# EasyEDA schematic SCH_GroeiAcademie-Arduino_Uno_R3-R4_Shield-v0.10.0_2026-07-25.json
TITLE: Stimulus: Arduino UNO R3/R4 + ADS1115; REV: 0.10.0; Date: 2026-07-25; Sheet: 1/1; Drawn By: Alex Peeters; Company: GROEI ACADEMIE
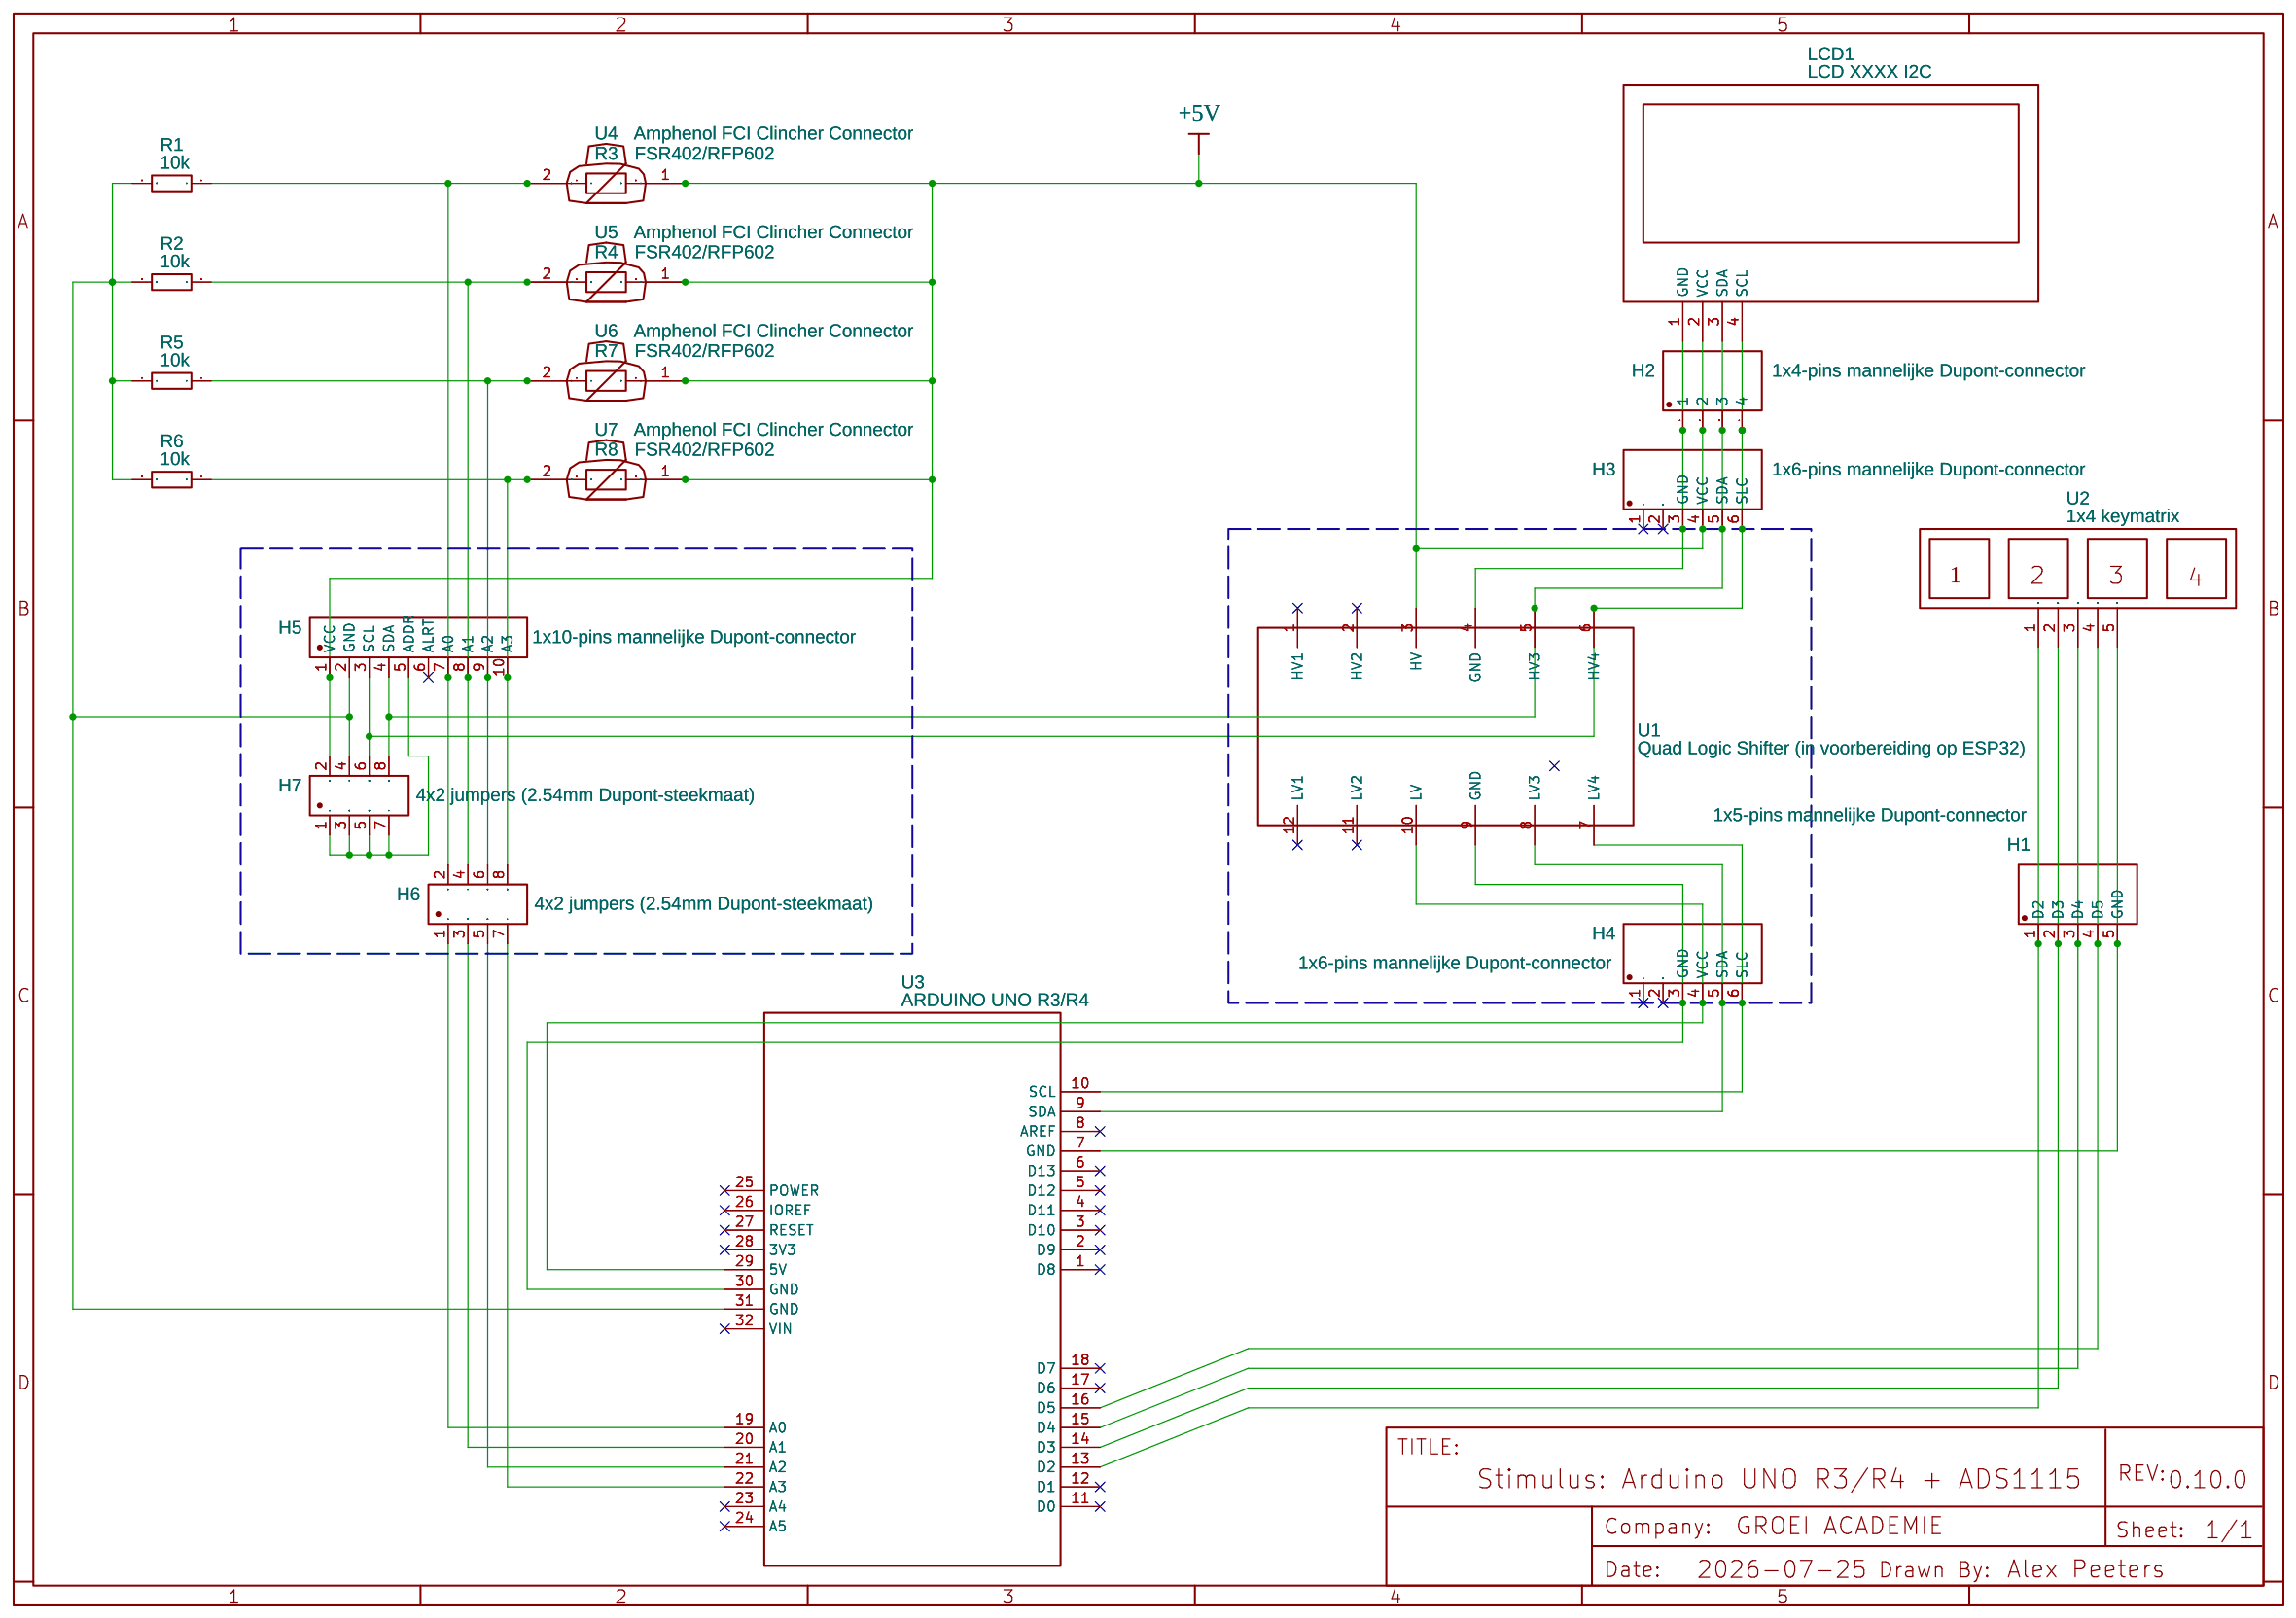
[diagram p0: schematic sheet]

## Parts
H1  1x5-pins mannelijke Dupont-connector  [HDR-TH_5P-P2.54-V-M]
H2  1x4-pins mannelijke Dupont-connector  [HDR-TH_4P-P2.54-V-M]
H3  1x6-pins mannelijke Dupont-connector  [HDR-TH_6P-P2.54-V_Z-211-0611-0021-001]
H4  1x6-pins mannelijke Dupont-connector  [HDR-TH_6P-P2.54-V_Z-211-0611-0021-001]
H5  1x10-pins mannelijke Dupont-connector  [HDR-TH_10P-P2.54-V-M]
H6  4x2 jumpers (2.54mm Dupont-steekmaat)  [HDR-SMD_8P-P2.54-V-M-R2-C4-LS7.4]
H7  4x2 jumpers (2.54mm Dupont-steekmaat)  [HDR-SMD_8P-P2.54-V-M-R2-C4-LS7.4]
LCD1  LCD XXXX I2C  [HDR-M-2.54_1X4]
R1  10k  [WEERSTAND _P 10MM]
R2  10k  [WEERSTAND _P 10MM]
R3  FSR402/RFP602  [FSR400]
R4  FSR402/RFP602  [FSR400]
R5  10k  [WEERSTAND _P 10MM]
R6  10k  [WEERSTAND _P 10MM]
R7  FSR402/RFP602  [FSR400]
R8  FSR402/RFP602  [FSR400]
U1  Quad Logic Shifter (in voorbereiding op ESP32)  [LOGIC SHIFTER 4 CH]
U2  1x4 keymatrix  [KEYPAD1X4]
U3  ARDUINO UNO R3/R4  [UNO_R3]
U4  Amphenol FCI Clincher Connector  [AT04-2P]
U5  Amphenol FCI Clincher Connector  [AT04-2P]
U6  Amphenol FCI Clincher Connector  [AT04-2P]
U7  Amphenol FCI Clincher Connector  [AT04-2P]

## Library data of the parts
H1 = 210S-1*5P L=11.6MMGold-plated black: Contributor: LCSC; Supplier: LCSC; Manufacturer: Ckmtw(灿科盟); Manufacturer Part: B-2100S05P-A110; Supplier Part: C124379; JLCPCB Part Class: Extended Part
H2 = Header-Male-2.54_1x4: Contributor: LCSC; Supplier: LCSC; Manufacturer: Ckmtw(灿科盟); Manufacturer Part: B-2100S04P-A110; Supplier Part: C124378; JLCPCB Part Class: Extended Part
H3 H4 = 210S-1*6P L=11.6MMGold-plated black: Contributor: LCSC; Supplier: LCSC; Manufacturer: Ckmtw(灿科盟); Manufacturer Part: B-2100S06P-A110; Supplier Part: C124380; JLCPCB Part Class: Extended Part
H5 = 2.54-1*10: Contributor: lcsc; Supplier: LCSC; Supplier Part: C5156617; Manufacturer: ZHOURI(洲日); JLCPCB Part Class: Extended Part
H6 H7 = 2.54-2*4P立贴针: Contributor: LCSC; Supplier: LCSC; Supplier Part: C192300; Manufacturer: BOOMELE(博穆精密); JLCPCB Part Class: Extended Part
LCD1 = I2CLCD16X2_N: Contributor: abdenoura70
R1 R2 R5 R6 = 330Ω (331) ±5%: Supplier: LCSC; Supplier Part: C10322; Manufacturer: Made in China; Contributor: Oldman2019; JLCPCB Part Class: Extended Part
R3 R4 R7 R8 = FSR402-OPCION1: Contributor: N.Morisaki
U1 = Quad Logic Shifter: Contributor: wsarchibald1
U2 = Клавиатура 4*4: Contributor: oleg12062005; sourceId: AztLFXf9r
U3 = UNO_R3: sourceId: 1T5FDZYC8
U4-U7 = AT04-2P: Manufacturer: Amphenol; Manufacturer Part: AT04-2P-BM02; Supplier: Mouser; Supplier Part: 654-AT04-2P-BM02; link: https://www.amphenol-sine.com/AT04-2P-BM02-2-Position-PCB-Flange-Mount-Receptacle-Pin-Gold-Plated-Contacts-Included-Potting-Black_p_9831.html; Contributor: aryde

## Nets
+5V: H2.2 H3.4(VCC) H5.1(VCC) H7.2 LCD1.2(VCC) R3.2 R4.2 R7.2 R8.2 U1.3(HV) U4.1 U5.1 U6.1 U7.1
Net-(H1-1): H1.1(D2) U2.1(C1) U3.13(D2)
Net-(H1-2): H1.2(D3) U2.2(C2) U3.14(D3)
Net-(H1-3): H1.3(D4) U2.3(C3) U3.15(D4)
Net-(H1-4): H1.4(D5) U2.4(R1) U3.16(D5)
Net-(H1-5): H1.5(GND) U2.5(R2) U3.7(GND)
Net-(H2-1): H2.1 H3.3(GND) LCD1.1(GND) U1.4(GND)
Net-(H2-3): H2.3 H3.5(SDA) H5.4(SDA) H7.8 LCD1.3(SDA) U1.5(HV3)
Net-(H2-4): H2.4 H3.6(SLC) H5.3(SCL) H7.6 LCD1.4(SCL) U1.6(HV4)
Net-(H4-3): H4.3(GND) U1.9(GND) U3.30(GND)
Net-(H4-4): H4.4(VCC) U1.10(LV) U3.29(5V)
Net-(H4-5): H4.5(SDA) U1.8(LV3) U3.9(SDA)
Net-(H4-6): H4.6(SLC) U1.7(LV4) U3.10(SCL)
Net-(H5-2): H5.2(GND) H7.4 R1.2 R2.2 R5.2 R6.2 U3.31(GND)
Net-(H5-5): H5.5(ADDR) H7.1 H7.3 H7.5 H7.7
Net-(H5-7): H5.7(A0) H6.2 R1.1 R3.1 U4.2
Net-(H5-8): H5.8(A1) H6.4 R2.1 R4.1 U5.2
Net-(H5-9): H5.9(A2) H6.6 R5.1 R7.1 U6.2
Net-(H5-10): H5.10(A3) H6.8 R6.1 R8.1 U7.2
Net-(H6-1): H6.1 U3.19(A0)
Net-(H6-3): H6.3 U3.20(A1)
Net-(H6-5): H6.5 U3.21(A2)
Net-(H6-7): H6.7 U3.22(A3)

Not connected (* = marked no-connect by the designer): H3 1* 2*; H4 1* 2*; H5 6(ALRT)*; U1 1(HV1)* 2(HV2)* 11(LV2)* 12(LV1)*; U3 1(D8)* 2(D9)* 3(D10)* 4(D11)* 5(D12)* 6(D13)* 8(AREF)* 11(D0)* 12(D1)* 17(D6)* 18(D7)* 23(A4)* 24(A5)* 25(POWER)* 26(IOREF)* 27(RESET)* 28(3V3)* 32(VIN)*
